# EAGLE design automation-v3 (EAGLE 7.6.0)
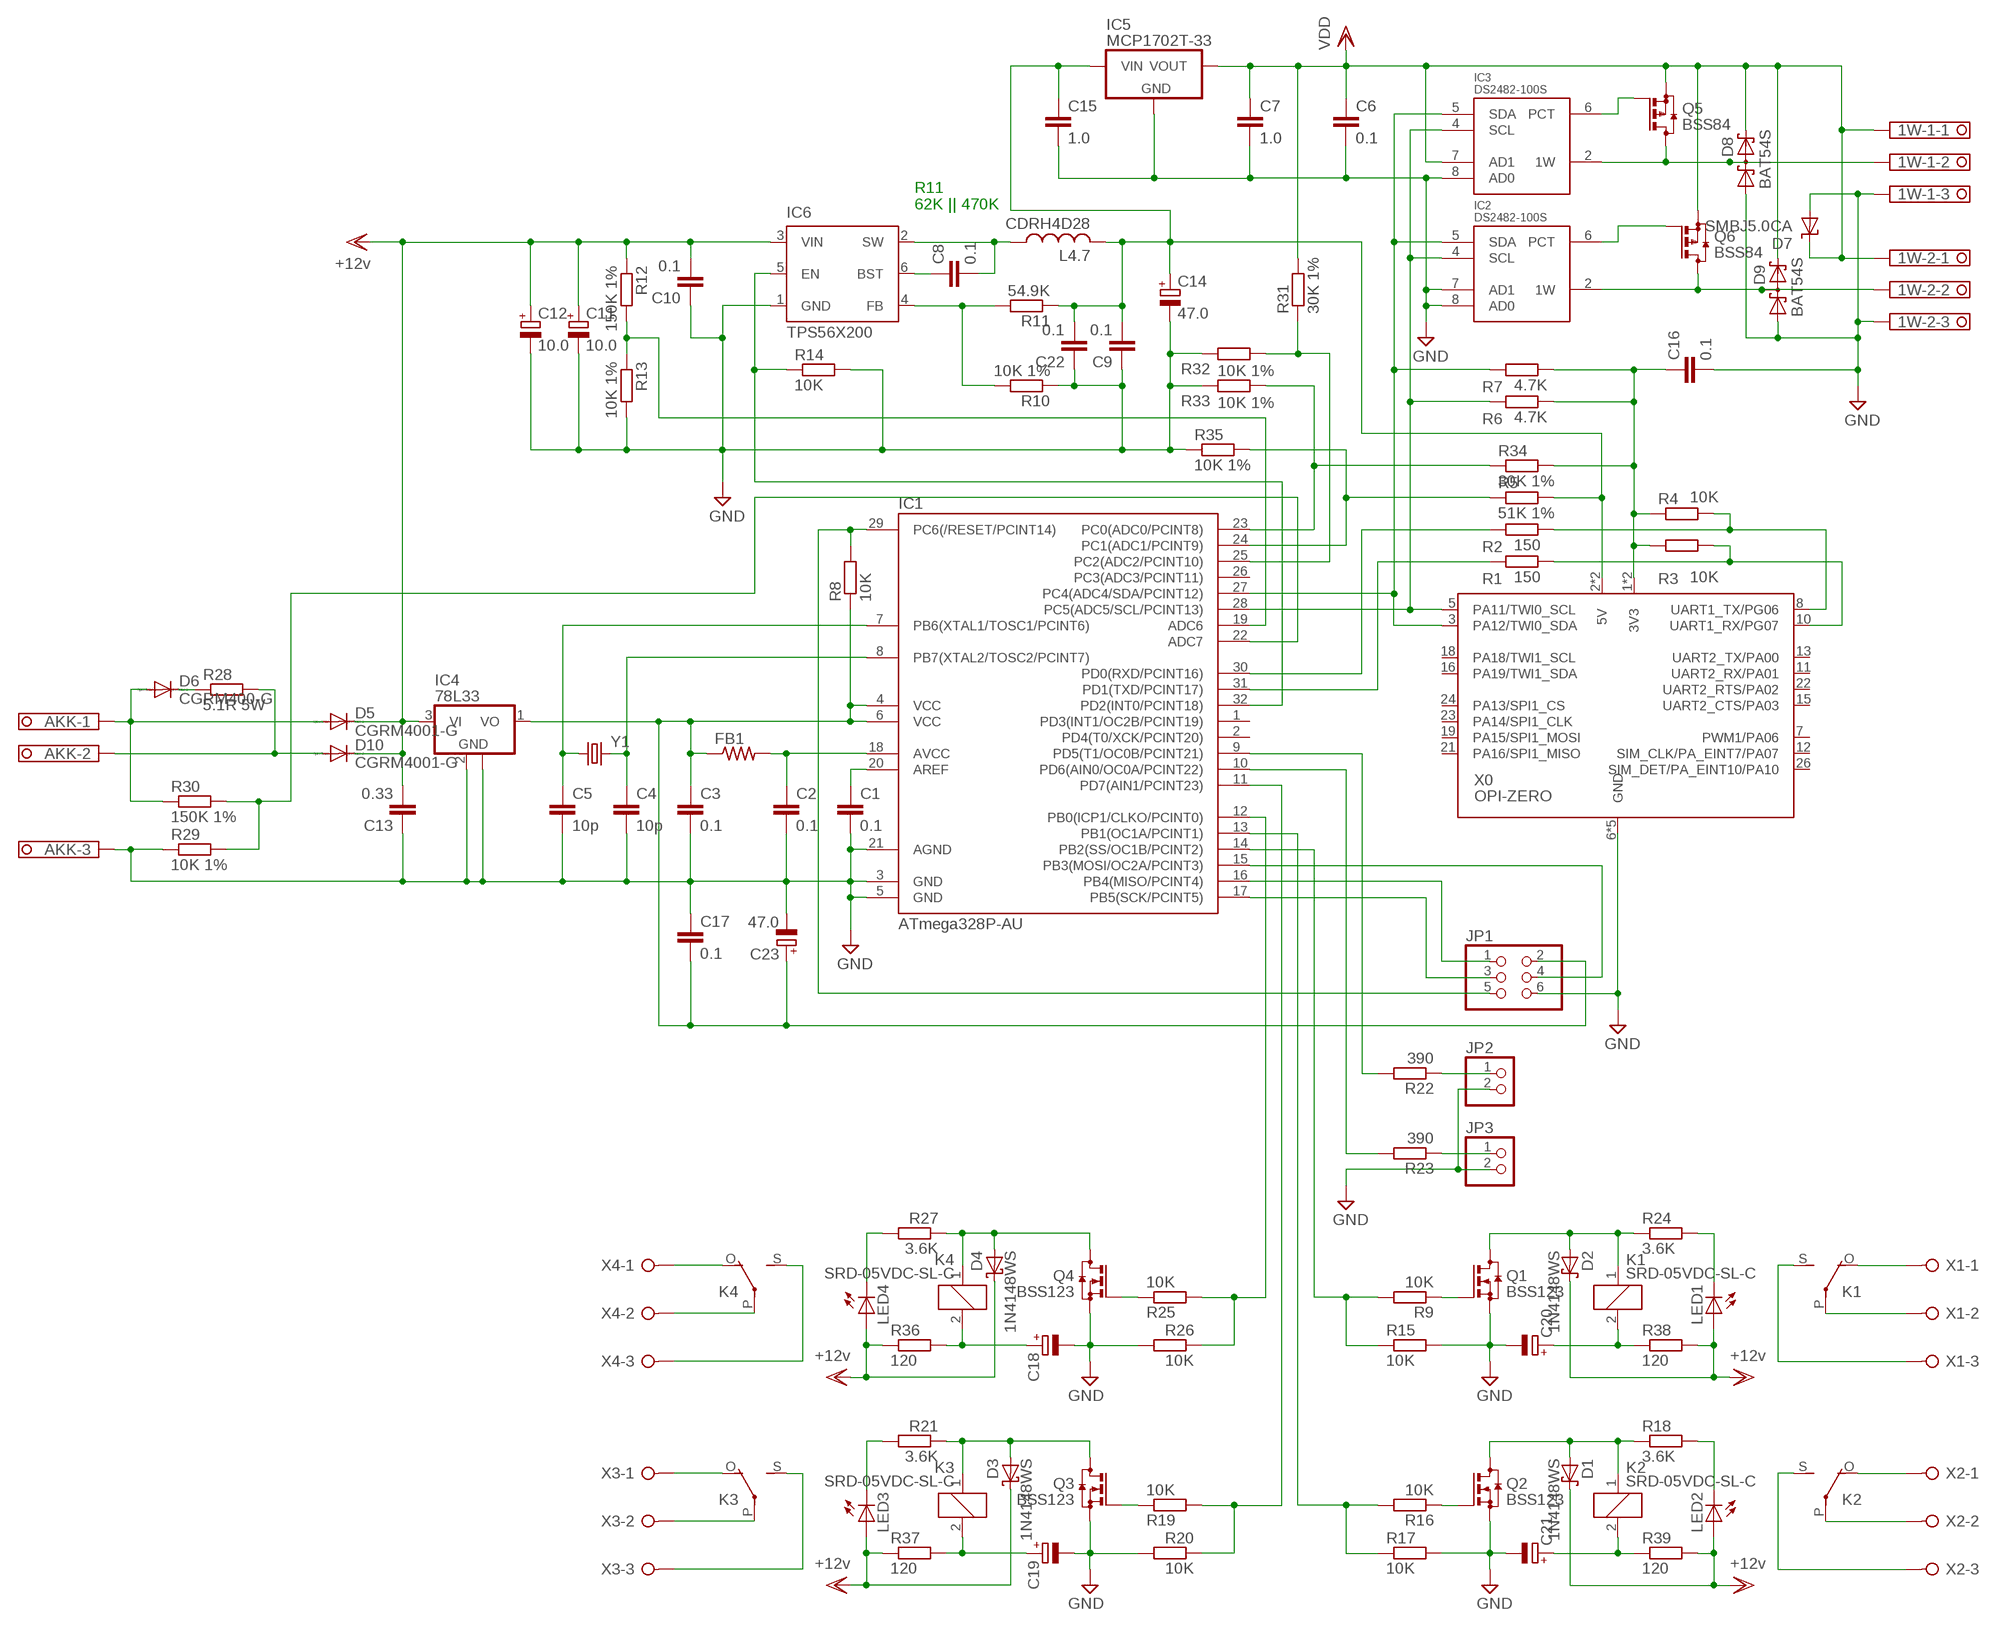
[diagram p0: schematic, sheet 1]

## Parts
1W-1  1751251  [1751251]
1W-2  1751251  [1751251]
AKK  1751251  [1751251]
C1  0.1  C-EUC0603  [C0603]
C2  0.1  C-EUC0603  [C0603]
C3  0.1  C-EUC0603  [C0603]
C4  10p  C-EUC0603  [C0603]
C5  10p  C-EUC0603  [C0603]
C6  0.1  C-EUC0603  [C0603]
C7  1.0  C-EUC0805  [C0805]
C8  0.1  C-EUC0805  [C0805]
C9  0.1  C-EUC0805  [C0805]
C10  0.1  C-EUC0805  [C0805]
C11  10.0  CPOL-EUC/6032-28R  [C/6032-28R]
C12  10.0  CPOL-EUC/6032-28R  [C/6032-28R]
C13  0.33  C-EUC0805  [C0805]
C14  47.0  CPOL-EUB/3528-21R  [B/3528-21R]
C15  1.0  C-EUC0805  [C0805]
C16  0.1  C-EUC0603  [C0603]
C17  0.1  C-EUC0603  [C0603]
C18  CPOL-EUE5-10.5  [E5-10,5]
C19  CPOL-EUE5-10.5  [E5-10,5]
C20  CPOL-EUE5-10.5  [E5-10,5]
C21  CPOL-EUE5-10.5  [E5-10,5]
C22  0.1  C-EUC0805  [C0805]
C23  47.0  CPOL-EUB/3528-21R  [B/3528-21R]
D1  1N4148WS  BAT60J  [SOD323_ST]
D2  1N4148WS  BAT60J  [SOD323_ST]
D3  1N4148WS  BAT60J  [SOD323_ST]
D4  1N4148WS  BAT60J  [SOD323_ST]
D5  CGRM4001-G  [SOD-123_MINI-SMA]
D6  CGRM400-G  CGRM4001-G  [SOD-123_MINI-SMA]
D7  SMBJ5.0CA  SUPPRESSOR-SMBJ  [SMBJ]
D8  BAT54S  [SOT23]
D9  BAT54S  [SOT23]
D10  CGRM4001-G  [SOD-123_MINI-SMA]
FB1  R-US_R0805  [R0805]
IC1  ATmega328P-AU  MEGA48/88/168-AU  [TQFP32-08]
IC2  DS2482-100S  [SO08]
IC3  DS2482-100S  [SO08]
IC4  78L33  78L05F  [SOT89]
IC5  MCP1702T-33  MCP1702SOT23  [SOT23-3-ROTATED]
IC6  TPS56X200  [TSOT23-6_DDC]
JP1  PINHD-2X3  [2X03]
JP2  PINHD-1X2  [1X02]
JP3  PINHD-1X2  [1X02]
K1  SRD-05VDC-SL-C  ZF112S  [NRP18]
K2  SRD-05VDC-SL-C  ZF112S  [NRP18]
K3  SRD-05VDC-SL-C  ZF112S  [NRP18]
K4  SRD-05VDC-SL-C  ZF112S  [NRP18]
L4.7  CDRH4D28  [CDRH4D28]
LED1  LEDSML0805  [SML0805]
LED2  LEDSML0805  [SML0805]
LED3  LEDSML0805  [SML0805]
LED4  LEDSML0805  [SML0805]
Q1  BSS123  [SOT23]
Q2  BSS123  [SOT23]
Q3  BSS123  [SOT23]
Q4  BSS123  [SOT23]
Q5  BSS84  [SOT23]
Q6  BSS84  [SOT23]
R1  150  R-EU_R0603  [R0603]
R2  150  R-EU_R0603  [R0603]
R3  10K  R-EU_R0603  [R0603]
R4  10K  R-EU_R0603  [R0603]
R5  51K 1%  R-EU_R0603  [R0603]
R6  4.7K  R-EU_R0603  [R0603]
R7  4.7K  R-EU_R0603  [R0603]
R8  10K  R-EU_R0603  [R0603]
R9  10K  R-EU_R0603  [R0603]
R10  10K 1%  R-EU_R0603  [R0603]
R11  54.9K  R-EU_R0603  [R0603]
R12  150K 1%  R-EU_R0603  [R0603]
R13  10K 1%  R-EU_R0603  [R0603]
R14  10K  R-EU_R0603  [R0603]
R15  10K  R-EU_R0603  [R0603]
R16  10K  R-EU_R0603  [R0603]
R17  10K  R-EU_R0603  [R0603]
R18  3.6K  R-EU_R0603  [R0603]
R19  10K  R-EU_R0603  [R0603]
R20  10K  R-EU_R0603  [R0603]
R21  3.6K  R-EU_R0603  [R0603]
R22  390  R-EU_R0603  [R0603]
R23  390  R-EU_R0603  [R0603]
R24  3.6K  R-EU_R0603  [R0603]
R25  10K  R-EU_R0603  [R0603]
R26  10K  R-EU_R0603  [R0603]
R27  3.6K  R-EU_R0603  [R0603]
R28  5.1R 5W  R-EU_VTA55  [VTA55]
R29  10K 1%  R-EU_R0603  [R0603]
R30  150K 1%  R-EU_R0603  [R0603]
R31  30K 1%  R-EU_R0603  [R0603]
R32  10K 1%  R-EU_R0603  [R0603]
R33  10K 1%  R-EU_R0603  [R0603]
R34  30K 1%  R-EU_R0603  [R0603]
R35  10K 1%  R-EU_R0603  [R0603]
R36  120  R-EU_M1206  [M1206]
R37  120  R-EU_M1206  [M1206]
R38  120  R-EU_M1206  [M1206]
R39  120  R-EU_M1206  [M1206]
X0  OPI-ZERO  [OPI0]
X1  W237-03P  [W237-133]
X2  W237-03P  [W237-133]
X3  W237-03P  [W237-133]
X4  W237-03P  [W237-133]
Y1  CRYSTALHC49US  [HC49US]

## Nets
12V [POWER]: C10.2 C11.+ C12.+ C13.2 D1.C D2.C D3.C D4.C D5.C D10.C IC4.3(VI) IC6.3(VIN) LED1.A LED2.A LED3.A LED4.A R12.1 R36.1 R37.1 R38.2 R39.2 ; supply symbol labelled +12v
GND [POWER]: 1W-1.3 1W-2.3 AKK.3 C1.2 C2.2 C3.2 C4.2 C5.2 C6.2 C7.2 C9.1 C10.1 C11.- C12.- C13.1 C14.- C15.2 C16.2 C17.1 C18.- C19.- C20.- C21.- C22.1 C23.- D7.A D8.1(A1) D9.1(A1) IC1.3(GND) IC1.5(GND) IC1.21(AGND) IC2.7(AD1) IC2.8(AD0) IC3.8(AD0) IC4.2(GND) IC4.2@1(GND) IC5.1(GND) IC6.1(GND) JP1.6 JP2.2 JP3.2 Q1.2(S) Q2.2(S) Q3.2(S) Q4.2(S) R10.1 R13.2 R14.2 R15.2 R17.2 R20.2 R26.2 R29.1 R32.2 R33.2 R35.1 X0.6(GND) X0.9(GND) X0.14(GND) X0.20(GND) X0.25(GND)
N$3 [POWER]: C8.2 IC6.2(SW) L4.7.P$1
N$4: C4.1 IC1.8(PB7(XTAL2/TOSC2/PCINT7)) Y1.2
N$5: IC1.30(PD0(RXD/PCINT16)) R2.1
N$6: IC1.31(PD1(TXD/PCINT17)) R1.1
N$7: R1.2 R3.2 X0.10(UART1_RX/PG07)
N$8: R2.2 R4.2 X0.8(UART1_TX/PG06)
N$9: C18.+ K4.2 R36.2
N$10: C5.1 IC1.7(PB6(XTAL1/TOSC1/PCINT6)) Y1.1
N$11: IC1.24(PC1(ADC1/PCINT9)) R5.1 R35.2
N$12 [POWER]: AKK.1 D5.A D6.A R30.1
N$13: IC1.29(PC6(/RESET/PCINT14)) JP1.5 R8.2
N$14: C19.+ K3.2 R37.2
N$15: C1.1 IC1.20(AREF)
N$16: C2.1 FB1.2 IC1.18(AVCC)
N$17: C8.1 IC6.6(BST)
N$18: IC1.15(PB3(MOSI/OC2A/PCINT3)) JP1.4
N$19: IC1.17(PB5(SCK/PCINT5)) JP1.3
N$20: IC1.16(PB4(MISO/PCINT4)) JP1.1
N$21: IC3.6(PCT) Q5.1(G)
N$22: IC6.4(FB) R10.2 R11.2
N$23: IC1.14(PB2(SS/OC1B/PCINT2)) R9.2 R15.1
N$24: IC1.13(PB1(OC1A/PCINT1)) R16.2 R17.1
N$25: IC1.19(ADC6) R12.2 R13.1
N$26: Q1.1(G) R9.1
N$27: IC1.32(PD2(INT0/PCINT18)) IC6.5(EN) R14.1
N$28 [HV]: K1.P(2:P) X1.2
N$29 [POWER]: D6.C R28.1
N$30: 1W-1.2 D8.3(C1A2) IC3.2(1W) Q5.3(D)
N$31 [POWER]: AKK.2 D10.A R28.2
N$32 [HV]: K1.S(2:S) X1.3
N$33 [HV]: K1.O(2:O) X1.1
N$34: Q2.1(G) R16.1
N$35: D1.A K2.1 Q2.3(D) R18.1
N$36: LED2.C R18.2
N$37: IC1.10(PD6(AIN0/OC0A/PCINT22)) R23.2
N$38: IC1.9(PD5(T1/OC0B/PCINT21)) R22.2
N$39: JP2.1 R22.1
N$40: JP3.1 R23.1
N$41: D2.A K1.1 Q1.3(D) R24.1
N$42 [HV]: K2.P(2:P) X2.2
N$43: LED1.C R24.2
N$44 [HV]: K2.S(2:S) X2.3
N$45 [HV]: K2.O(2:O) X2.1
N$46: IC1.11(PD7(AIN1/PCINT23)) R19.2 R20.1
N$47: Q3.1(G) R19.1
N$48: D3.A K3.1 Q3.3(D) R21.1
N$49: LED3.C R21.2
N$50 [HV]: K3.P(2:P) X3.2
N$51 [HV]: K3.S(2:S) X3.3
N$52 [HV]: K3.O(2:O) X3.1
N$53: IC1.12(PB0(ICP1/CLKO/PCINT0)) R25.2 R26.1
N$54: Q4.1(G) R25.1
N$55: D4.A K4.1 Q4.3(D) R27.1
N$56: LED4.C R27.2
N$57 [HV]: K4.P(2:P) X4.2
N$58 [HV]: K4.S(2:S) X4.3
N$59 [HV]: K4.O(2:O) X4.1
N$60: 1W-2.2 D9.3(C1A2) IC2.2(1W) Q6.3(D)
N$61: IC1.22(ADC7) R29.2 R30.2
N$62: IC1.25(PC2(ADC2/PCINT10)) R31.1 R32.1
N$63: C20.+ K1.2 R38.1
N$64: IC1.23(PC0(ADC0/PCINT8)) R33.1 R34.1
N$65: IC2.6(PCT) Q6.1(G)
N$66: C21.+ K2.2 R39.1
SCL: IC1.28(PC5(ADC5/SCL/PCINT13)) IC2.4(SCL) IC3.4(SCL) R6.1 X0.5(PA11/TWI0_SCL)
SDA: IC1.27(PC4(ADC4/SDA/PCINT12)) IC2.5(SDA) IC3.5(SDA) R7.1 X0.3(PA12/TWI0_SDA)
VCC [POWER]: C3.1 C17.2 C23.+ FB1.1 IC1.4(VCC) IC1.6(VCC) IC4.1(VO) JP1.2 R8.1
VDD: 1W-1.1 1W-2.1 C6.1 C7.1 D7.C D8.2(C2) D9.2(C2) IC3.7(AD1) IC5.2(VOUT) Q5.2(S) Q6.2(S) R31.2
Z3V3 [POWER]: C16.1 R3.1 R4.1 R6.2 R7.2 R34.2 X0.1(3V3) X0.17(3V3)
Z5V [POWER]: C9.2 C14.+ C15.1 C22.2 IC5.3(VIN) L4.7.P$2 R5.2 R11.1 X0.2(5V) X0.4(5V)
Unconnected: IC1.1(PD3(INT1/OC2B/PCINT19)) IC1.2(PD4(T0/XCK/PCINT20)) IC1.26(PC3(ADC3/PCINT11)) X0.7(PWM1/PA06) X0.11(UART2_RX/PA01) X0.12(SIM_CLK/PA_EINT7/PA07) X0.13(UART2_TX/PA00) X0.15(UART2_CTS/PA03) X0.16(PA19/TWI1_SDA) X0.18(PA18/TWI1_SCL) X0.19(PA15/SPI1_MOSI) X0.21(PA16/SPI1_MISO) X0.22(UART2_RTS/PA02) X0.23(PA14/SPI1_CLK) X0.24(PA13/SPI1_CS) X0.26(SIM_DET/PA_EINT10/PA10)

## Notes on the sheet
- R11
  62K || 470K

## Power pins joined to a net without a drawn wire
GND: IC2.3(GND) IC3.3(GND)
VDD: IC2.1(VDD) IC3.1(VDD)

## Library data of the parts
1W-1 1W-2 AKK = con-phoenix-350:1751251: MKDS 1/ 3-3,5 Printklemme Nennstrom: 10 A Bemessungsspannung: 160 V Raster: 3,5 mm Polzahl: 3 Montageart: Löten Anschlussart: Schraubanschluss Anschlussrichtung vom Leiter zur Platine: 0° Source: http://eshop.phoenixcontact.com .. 1751251.pdf; OC_FARNELL: unknown; OC_NEWARK: unknown
C1-C10 C13 C15-C17 C22 = rcl:C-EU: CAPACITOR, European symbol
C11 C12 C14 C18-C21 C23 = rcl:CPOL-EU: POLARIZED CAPACITOR, European symbol
D1-D4 = diode:BAT60J: Schottky barrier diode Source: www.st.com, BAT60J.pdf
D5 D6 D10 = diode:CGRM400*-G: Molded plasitc,JEDEC SOD-123/Mini SMA Source: Comchip CGRM4001-G.pdf
D7 = diode:SUPPRESSOR-: Suppressor diode
D8 D9 = diode:BAT54S: Schottky Diodes Pin connection corrected 2011-05-04 Source: Fairchild .. BAT54.pdf
FB1 = rcl:R-US_: RESISTOR, American symbol
IC1 = avr-7:MEGA48/88/168
IC2 IC3 = 1wire:DS2482-100: I2C to 1-Wire Host Adapter/Line Driver This device is a onewire host and I2C interface in one chip. It provides the complete DC/AC requirements for onewire communication, including overdrive speed mode, but, unlike the DS2480B chip, no 12V EPROM programming. Notes: For overdrive speed and 5V EEPROM programming, an external active pullup circuit must be connected to the 1W, VDD and PCT pin. See the datasheet for details. The lower two I2C adress bits of the chip can be selected by external pins, so up to 4 chips may be connected to the same I2C bus. Author: Orginal device and description from Giovanni Varasano <giovanni.varasano@fastwebnet.it> Improved by Jan Kandziora <jjj@gmx.de>
IC4 = linear:78L*: POSITOIV-VOLTAGE REGULATORS Output up to 100 mA Source: Datasheet <http://focus.ti.com/lit/ds/symlink/ua78l05.pdf>
IC5 = SteveMarple:MCP1702: Microchip MCP1702 250mA low quiescent current (2uA) LDO voltage regulator.
IC6 = custom:TPS56X200
JP1 = pinhead:PINHD-2X3: PIN HEADER
JP2 JP3 = pinhead:PINHD-1X2: PIN HEADER
K1-K4 = relay:ZF112: RELAY 1 x switch
L4.7 = custom:CDRH4D28
LED1-LED4 = led:LED: LED OSRAM: - CHIPLED LG R971, LG N971, LY N971, LG Q971, LY Q971, LO R971, LY R971 LH N974, LH R974 LS Q976, LO Q976, LY Q976 LO Q996 - Hyper CHIPLED LW Q18S LB Q993, LB Q99A, LB R99A - SideLED LS A670, LO A670, LY A670, LG A670, LP A670 LB A673, LV A673, LT A673, LW A673 LH A674 LY A675 LS A676, LA A676, LO A676, LY A676, LW A676 LS A679, LY A679, LG A679 - Hyper Micro SIDELED® LS Y876, LA Y876, LO Y876, LY Y876 LT Y87S - SmartLED LW L88C, LW L88S LB L89C, LB L89S, LG L890 LS L89K, LO L89K, LY L89K LS L896, LA L896, LO L896, LY L896 - TOPLED LS T670, LO T670, LY T670, LG T670, LP T670 LSG T670, LSP T670, LSY T670, LOP T670, LYG T670 LG T671, LOG T671, LSG T671 LB T673, LV T673, LT T673, LW T673 LH T674 LS T676, LA T676, LO T676, LY T676, LB T676, LH T676, LSB T676, LW T676 LB T67C, LV T67C, LT T67C, LS T67K, LO T67K, LY T67K, LW E67C LS E67B, LA E67B, LO E67B, LY E67B, LB E67C, LV E67C, LT E67C LW T67C LS T679, LY T679, LG T679 LS T770, LO T770, LY T770, LG T770, LP T770 LB T773, LV T773, LT T773, LW T773 LH T774 LS E675, LA E675, LY E675, LS T675 LS T776, LA T776, LO T776, LY T776, LB T776 LHGB T686 LT T68C, LB T68C - Hyper Mini TOPLED® LB M676 - Mini TOPLED Santana® LG M470 LS M47K, LO M47K, LY M47K Source: http://www.osram.convergy.de LUXEON: - LUMILED® LXK2-PW12-R00, LXK2-PW12-S00, LXK2-PW14-U00, LXK2-PW14-V00 LXK2-PM12-R00, LXK2-PM12-S00, LXK2-PM14-U00 LXK2-PE12-Q00, LXK2-PE12-R00, LXK2-PE12-S00, LXK2-PE14-T00, LXK2-PE14-U00 LXK2-PB12-K00, LXK2-PB12-L00, LXK2-PB12-M00, LXK2-PB14-N00, LXK2-PB14-P00, LXK2-PB14-Q00 LXK2-PR12-L00, LXK2-PR12-M00, LXK2-PR14-Q00, LXK2-PR14-R00 LXK2-PD12-Q00, LXK2-PD12-R00, LXK2-PD12-S00 LXK2-PH12-R00, LXK2-PH12-S00 LXK2-PL12-P00, LXK2-PL12-Q00, LXK2-PL12-R00 Source: www.luxeon.com KINGBRIGHT: KA-3528ASYC Source: www.kingbright.com
Q1-Q4 = transistor-small-signal:BSS123: N-CHANNEL MOS FET
Q5 Q6 = transistor-small-signal:BSS84: P-CHANNEL MOS FET
R1-R39 = rcl:R-EU_: RESISTOR, European symbol
X0 = OrangePi0:OPI-ZERO: Orange Pi Zero Footprint. Only 2x13 pin header. -- UNTESTED!
X1-X4 = con-wago-508:W237-03P: WAGO SREW CLAMP; OC_FARNELL: unknown; OC_NEWARK: unknown
Y1 = SteveMarple:CRYSTAL: Crystals Various standard crystals. Proven footprints. Spark Fun Electronics SKU : COM-00534

## Net classes
0 default: width 0.254 mm, clearance 0.254 mm
1 POWER: width 0.508 mm, clearance 0.254 mm
2 HV: width 1.27 mm, clearance 1.27 mm

## Board
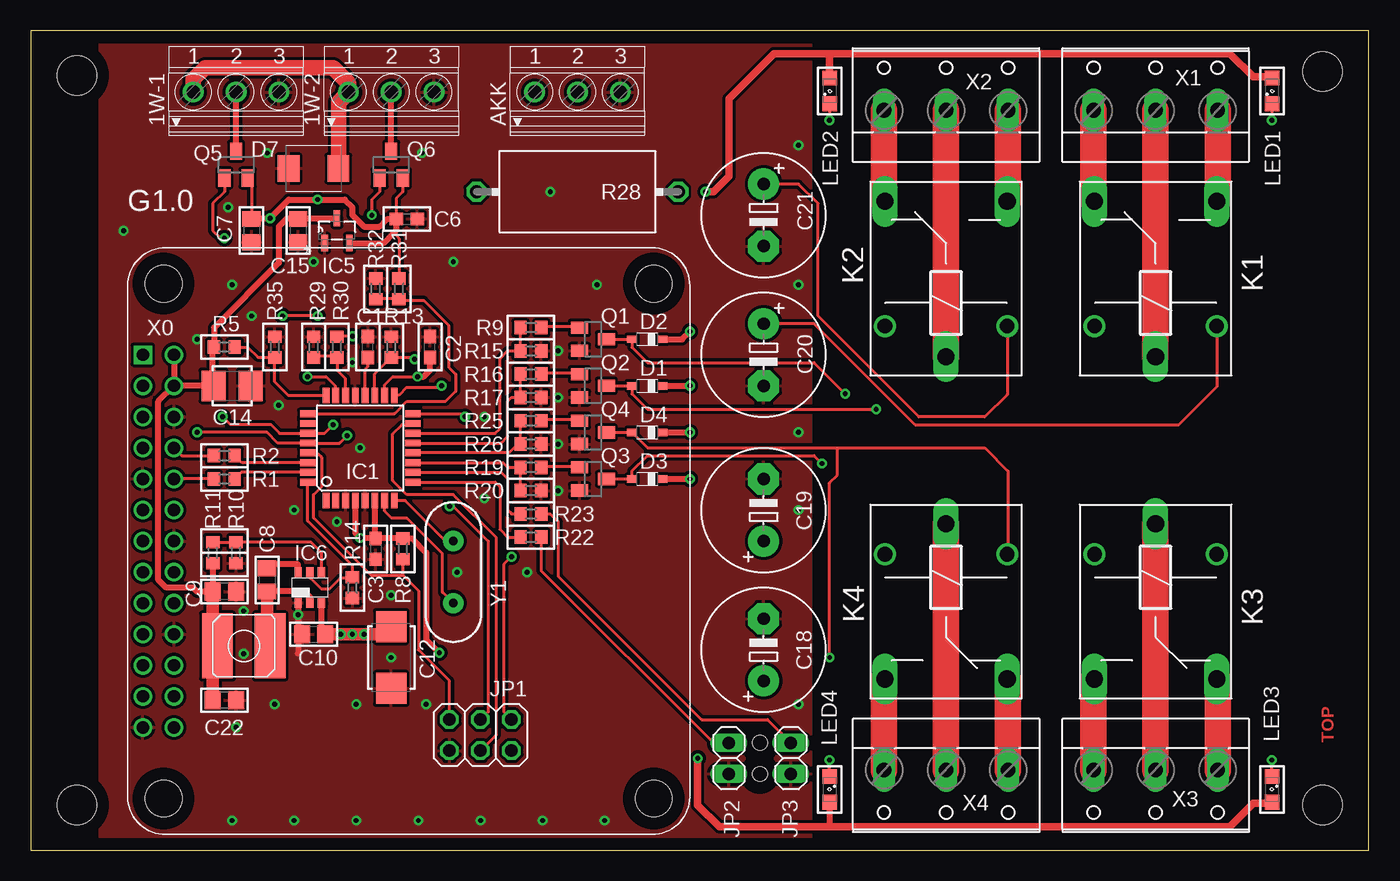
[diagram p1: board, top side]
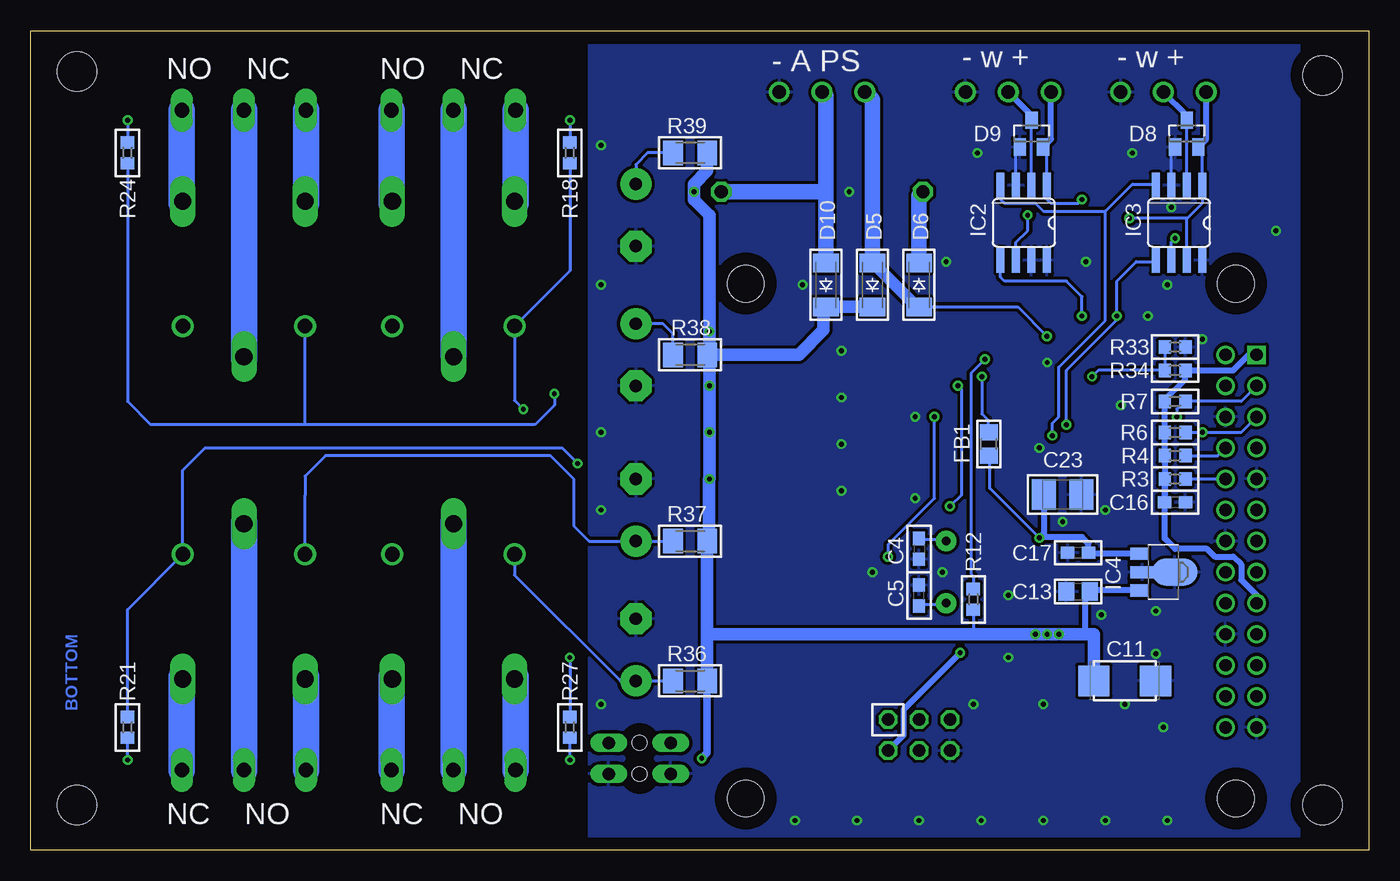
[diagram p2: board, bottom side, seen from below]

Size 109.53 x 67.04 mm. Coordinates in mm from the lower left corner, seen from the top.
Outline: 109.53,0 109.53,67.04 0,67.04 0,0 109.53,0
Copper layers (1*16): Top 0.035mm / dielectric 1.5mm / Bottom 0.035mm
Design rules "default *": minimum track width 10mil, minimum drill 16mil, track to track 10mil, track to pad 10mil, pad to pad 10mil, via to via 10mil, smd to smd 10mil, copper to edge 40mil, drill to drill 10mil, minimum pad ring 10mil, minimum via ring 8mil, stop-mask expansion 4mil, vias tented up to drill 20mil, thermal gap 10mil
Holes 3.2 mm at 3.8,63.37 105.72,63.69 105.72,3.68 3.8,3.68
Holes 1.2 mm at 59.68,8.76 59.68,6.22

### Footprints (pad centres in the part's own frame; a part is rotated, then mirrored left to right if it is on the bottom)
1751251 = drill 1.1 pad 1.7: 1 -3.5,-0.1; 2 0,-0.1; 3 3.5,-0.1
C0603 = smd 1.1 x 1: 1 -0.85,0; 2 0.85,0
C0805 = smd 1.3 x 1.5: 1 -0.95,0; 2 0.95,0
C/6032-28R = smd 2.55 x 2.5: + 2.525,0; - -2.525,0
B/3528-21R = smd 1.95 x 2.5: + 1.525,0; - -1.525,0
E5-10,5 = drill 1.016 pad 2.54: + -2.54,0 | drill 1.016 pad 2.54 octagon: - 2.54,0
SOD323_ST = smd 0.8 x 0.6: A 1.25,0; C -1.25,0
SOD-123_MINI-SMA = smd 1.5 x 2.1: A 1.8,0; C -1.8,0
SMBJ = smd 1.78 x 2.16: A 2.04,0; C -2.03,0
SOT23 = smd 1 x 1.4: 1 -0.95,-1.1; 2 0.95,-1.1; 3 0,1.1
R0805 = smd 1.3 x 1.5: 1 -0.95,0; 2 0.95,0
TQFP32-08 = smd 1.27 x 0.559: 1 -4.293,2.8; 2 -4.293,2; 3 -4.293,1.2; 4 -4.293,0.4; 5 -4.293,-0.4; 6 -4.293,-1.2; 7 -4.293,-2; 8 -4.293,-2.8; 17 4.293,-2.8; 18 4.293,-2; 19 4.293,-1.2; 20 4.293,-0.4; 21 4.293,0.4; 22 4.293,1.2; 23 4.293,2; 24 4.293,2.8 | smd 0.559 x 1.27: 9 -2.8,-4.293; 10 -2,-4.293; 11 -1.2,-4.293; 12 -0.4,-4.293; 13 0.4,-4.293; 14 1.2,-4.293; 15 2,-4.293; 16 2.8,-4.293; 25 2.8,4.293; 26 2,4.293; 27 1.2,4.293; 28 0.4,4.293; 29 -0.4,4.293; 30 -1.2,4.293; 31 -2,4.293; 32 -2.8,4.293
SO08 = smd 0.66 x 2.032: 1 -1.905,-3.073; 2 -0.635,-3.073; 3 0.635,-3.073; 4 1.905,-3.073; 5 1.905,3.073; 6 0.635,3.073; 7 -0.635,3.073; 8 -1.905,3.073
SOT89 = smd 1 x 1.5: 1 -1.499,-1.981; 3 1.499,-1.981 | smd 1 x 2: 2 0,-1.727 | smd 2.2 x 3.7: 2@1 0,0.94
SOT23-3-ROTATED = smd 1.321 x 0.559: 1 -1.016,1.016; 2 -1.016,-1.016; 3 1.016,0
TSOT23-6_DDC = smd 0.6 x 0.8: 1 -0.95,-1.25; 2 0,-1.25; 3 0.95,-1.25; 4 0.95,1.25; 5 0,1.25; 6 -0.95,1.25
2X03 = drill 1.016 octagon: 1 -2.54,-1.27; 2 -2.54,1.27; 3 0,-1.27; 4 0,1.27; 5 2.54,-1.27; 6 2.54,1.27
1X02 = drill 1.016 long: 1 -1.27,0; 2 1.27,0
NRP18 = drill 1.2: 1 -4,5; 2 -4,-5 | drill 1.4 long: O 6.2,5; P -6.5,0; S 6.2,-5
CDRH4D28 = smd 2.5 x 5.3: P$1 -2.159,0; P$2 2.159,0
SML0805 = smd 1.2 x 1.2: A 1.05,0; C -1.05,0
R0603 = smd 1 x 1.1: 1 -0.85,0; 2 0.85,0
VTA55 = drill 1.1 octagon: 1 -8.255,0; 2 8.255,0
M1206 = smd 1.6 x 2: 1 -1.4,0; 2 1.4,0
OPI0 = drill 1 square: 1 0,0 | drill 1: 2 0,2.54; 3 2.54,0; 4 2.54,2.54; 5 5.08,0; 6 5.08,2.54; 7 7.62,0; 8 7.62,2.54; 9 10.16,0; 10 10.16,2.54; 11 12.7,0; 12 12.7,2.54; 13 15.24,0; 14 15.24,2.54; 15 17.78,0; 16 17.78,2.54; 17 20.32,0; 18 20.32,2.54; 19 22.86,0; 20 22.86,2.54; 21 25.4,0; 22 25.4,2.54; 23 27.94,0; 24 27.94,2.54; 25 30.48,0; 26 30.48,2.54 | hole 3: -5.815,1.694; 36.295,1.694; 36.295,41.805; -5.815,41.805
W237-133 = drill 1.194 long: 1 -5.08,-0.635; 2 0,-0.635; 3 5.08,-0.635
HC49US = drill 0.7 pad 1.651: 1 -2.54,0; 2 2.54,0

### Placement (x,y rotation side)
1W-1  16.81,62.1 0 top
1W-2  29.52,62.1 0 top
AKK  44.75,62.1 0 top
C1  27.61,41.15 90 top
C2  32.69,41.15 90 top
C3  28.25,24.64 270 top
C4  36.82,24.64 270 bottom
C5  36.82,20.83 90 bottom
C6  30.79,51.63 0 top
C7  18.09,50.67 270 top
C8  19.36,22.1 270 top
C9  15.86,21.15 180 top
C10  23.16,17.65 0 top
C11  19.99,13.84 180 bottom
C12  29.52,15.75 90 top
C13  23.8,21.15 0 bottom
C14  16.5,37.97 180 top
C15  21.89,50.67 270 top
C16  15.86,28.45 0 bottom
C17  23.8,24.32 0 bottom
C18  60,16.38 90 top
C19  60,27.81 90 top
C20  60,40.51 270 top
C21  60,51.94 270 top
C22  15.86,12.26 180 top
C23  25.07,29.08 180 bottom
D1  50.47,37.97 180 top
D2  50.47,41.78 180 top
D3  50.47,30.35 180 top
D4  50.47,34.16 180 top
D5  40.63,46.23 90 bottom
D6  36.82,46.23 270 bottom
D7  23.16,55.75 180 top
D8  14.91,58.61 0 bottom
D9  27.61,58.61 0 bottom
D10  44.44,46.23 90 bottom
FB1  31.1,33.21 90 bottom
IC1  26.98,32.89 90 top
IC2  28.25,51.31 180 bottom
IC3  15.54,51.31 180 bottom
IC4  16.81,22.73 270 bottom
IC5  25.07,50.67 90 top
IC6  22.85,21.46 0 top
JP1  36.82,9.4 180 top
JP2  57.14,7.49 270 top
JP3  62.22,7.49 270 top
K1  92.06,46.86 90 top
K2  74.92,46.86 90 top
K3  92.06,20.19 270 top
K4  74.92,20.19 270 top
L4.7  17.45,16.7 180 top
LED1  101.59,62.1 90 top
LED2  65.39,62.1 90 top
LED3  101.59,4.95 270 top
LED4  65.39,4.95 270 top
Q1  46.03,41.78 270 top
Q2  46.03,37.97 270 top
Q3  46.03,30.35 270 top
Q4  46.03,34.16 270 top
Q5  16.81,56.07 0 top
Q6  29.52,56.07 0 top
R1  15.86,30.35 180 top
R2  15.86,32.26 180 top
R3  15.86,30.35 0 bottom
R4  15.86,32.26 0 bottom
R5  15.86,41.15 180 top
R6  15.86,34.16 180 bottom
R7  15.86,36.7 180 bottom
R8  30.47,24.64 270 top
R9  40.94,42.74 180 top
R10  16.81,24.32 90 top
R11  14.91,24.32 90 top
R12  32.37,20.51 90 bottom
R13  29.52,41.15 90 top
R14  26.34,21.46 270 top
R15  40.94,40.83 0 top
R16  40.94,38.93 180 top
R17  40.94,37.02 0 top
R18  65.39,57.02 90 bottom
R19  40.94,31.31 180 top
R20  40.94,29.4 0 top
R21  101.59,10.03 270 bottom
R22  40.94,25.59 180 top
R23  40.94,27.5 180 top
R24  101.59,57.02 90 bottom
R25  40.94,35.12 180 top
R26  40.94,33.21 0 top
R27  65.39,10.03 270 bottom
R28  44.75,53.85 0 top
R29  23.16,41.15 270 top
R30  25.07,41.15 270 top
R31  30.15,45.91 90 top
R32  28.25,45.91 90 top
R33  15.86,41.15 0 bottom
R34  15.86,39.24 0 bottom
R35  19.99,41.15 270 top
R36  55.55,13.84 180 bottom
R37  55.55,25.27 180 bottom
R38  55.55,40.51 0 bottom
R39  55.55,57.02 0 bottom
X0  9.2,40.51 270 top
X1  92.06,61.15 0 top
X2  74.92,61.15 0 top
X3  92.06,5.91 180 top
X4  74.92,5.91 180 top
Y1  34.59,22.73 90 top

### Tracks (layer width: path | path; a pad name or v marks a point on that pad's centre or on a via)
12V  (via drill 0.4)
  Top 0.508: D2.C 53.33,41.78 v53.96,42.42 | D1.C v53.96,37.97 | D4.C v53.96,34.16 | D3.C v53.96,30.35 | 23.8,20.19 23.86,20.19 IC6.3 23.8,17.65 C10.2 | 65.39,3.94 LED4.A | 101.59,3.81 LED3.A | 65.52,3.68 LED4.A | 65.39,63.12 LED2.A 65.52,63.37 | 101.59,63.25 LED1.A | LED4.A 65.39,1.91
  Top 0.61: 101.59,3.81 100.06,3.81 98.16,1.91 65.39,1.91 56.38,1.91 54.6,3.68 v54.6,7.49 | 101.59,63.25 100.06,63.25 98.16,65.15 65.39,65.15 | 65.39,65.15 60.82,65.15 57.14,61.47 57.14,55.12 55.87,53.85 v55.23,53.85 | LED2.A 65.39,65.15
  Top 1.016: 29.18,17.65 C12.+ 29.2,17.65 v27.29,17.65 v26.34,17.65 v25.39,17.65 C10.2
  Bottom 0.254: R12.1 32.37,17.65 | 23.26,17.88
  Bottom 0.508: R36.1 | R37.1 54.03,25.4 | 54.03,41.21 v53.96,42.42 | 54.03,30.29 v53.96,30.35 | 44.37,44.45 D10.C | 44.63,44.32 D10.C | 40.69,44.45 D5.C | 44.12,44.45 D10.C | IC4.3 22.85,21.23 | 22.85,21.23 23.26,21.23 23.26,17.88 | 23.26,17.88 23.48,17.65 | C13.2 22.85,21.23 | R38.2 53.96,40.51
  Bottom 0.61: v54.6,7.49 54.15,7.94 R36.1
  Bottom 1.016: R37.1 54.15,17.65 | 54.15,17.65 R36.1 | v53.96,30.35 v53.96,34.16 v53.96,37.97 53.96,40.51 v53.96,42.42 53.96,51.94 55.23,53.21 v55.23,53.85 55.23,54.48 54.15,55.57 R39.2 | 54.03,25.4 54.03,30.29 | 44.12,44.45 40.69,44.45 | 54.15,17.65 32.37,17.65 v27.29,17.65 23.48,17.65 22.53,17.65 22.53,13.86 C11.+ | 44.63,44.32 44.63,42.54 46.66,40.51 R38.2
GND  (via drill 0.4)
  Top 0.508: IC6.1 21.89,16.07
  Bottom 0.254: IC2.3 28.88,57.19 D9.1 | IC3.3 16.18,57.19 D8.1
  other vias: 43.17,29.4 43.17,33.21 43.17,37.02 43.17,40.83 34.91,22.73 62.85,46.23 7.61,50.67 23.16,48.13 34.59,48.13 13.64,41.78 21.58,27.81 29.52,15.75 42.53,53.85 26.98,32.89 26.66,11.94 37.14,28.77 40.63,22.73 16.5,2.41 26.66,2.41 31.74,2.41 46.98,2.41 19.36,57.02 32.05,57.02 29.52,20.83 37.14,35.43 46.34,46.23 20.31,36.39 18.09,43.69 26.34,39.88 25.07,26.86 32.37,11.94 21.89,19.24 17.45,19.56 17.45,16.07 19.99,11.94 16.81,10.03 62.85,34.16 36.82,2.41 41.9,2.41 21.58,2.41 62.85,27.81 62.85,11.94 62.85,57.66 16.18,52.58 16.5,46.23
  pour Bottom: 5.7,0.83 5.7,66.23 63.81,66.23 63.81,0.83
  pour Top: 5.7,0.83 5.7,66.23 63.81,66.23 63.81,0.83
N$3
  Top 0.508: IC6.2 22.85,20.7 22.34,21.21 19.36,21.21 C8.2
  Top 1.016: L4.7.P$1 19.36,16.95 C8.2
N$4
  Top 0.254: Y1.2 33.96,25.27 30.66,28.58 29.9,28.58 IC1.8
  Bottom 0.254: Y1.2 34.72,25.4 36.75,25.4 C4.1
N$5
  Top 0.254: IC1.30 17.28,31.69 R2.1
N$6
  Top 0.254: IC1.31 17.25,30.89 R1.1
N$7
  Top 0.254: 15.04,30.35 R3.2 X0.10
  Bottom 0.254: R3.2 X0.10
N$8
  Top 0.254: X0.8 12.37,32.26 R4.2
  Bottom 0.254: R4.2 12.37,32.26 X0.8
N$9
  Bottom 0.254: R36.2 C18.+ 61.26,13.84 69.92,22.5 K4.2
N$10
  Top 0.254: 29.01,28.58 IC1.7 28.98,27.72 29.52,27.18 30.79,27.18 33.71,24.26 33.71,21.08 Y1.1
  Bottom 0.254: Y1.1 34.72,20.07 36.75,20.07 C5.1
N$11
  Top 0.254: IC1.24 24.05,37.21 21.07,37.21 19.99,38.29 R35.2 18.62,40.3 17.77,41.15 R5.1
N$12  (via drill 0.41)
  Top 0.254: v26.34,42.04 25.07,42.04
  Top 0.508: 25.07,42.04 R30.1
  Bottom 0.254: D6.A 28.73,44.43 v26.34,42.04
  Bottom 0.508: 36.82,44.32 D6.A 37.01,44.45 | 40.56,48.01 D5.A 40.69,48.26
  Bottom 1.016: 37.01,44.45 40.56,48.01
  Bottom 1.27: D5.A 40.63,61.38 AKK.1
N$13
  Top 0.254: IC1.29 22.78,32.38 23.55,32.38 23.8,32.13 23.8,29.72 23.16,29.08 23.16,27.18 27.86,22.48 30.47,22.48 | 30.47,22.73 R8.2 30.47,22.48 | 30.47,22.48 31.74,21.21 31.74,16.38 34.28,13.84 JP1.5
N$14
  Bottom 0.254: R37.2 C19.+ 63.81,25.27 65.07,26.54 65.07,30.35 66.98,32.26 85.4,32.26 87.06,30.59 87.06,29 87.06,28.45 K3.2
N$15
  Top 0.254: IC1.20 27.38,39.33 27.61,39.56 C1.1
N$16  (via drill 0.41)
  Top 0.254: IC1.18 28.98,38.07 29.64,38.73 v31.67,38.73
  Top 0.508: C2.1 32.69,39.24 32.18,38.73 v31.67,38.73
  Bottom 0.254: v31.67,38.73 31.67,35.69 31.17,35.18 31.17,34.16 FB1.2
N$17
  Top 0.254: IC6.6 | 19.36,23.37 C8.1
  Top 0.508: IC6.6 21.89,23.37 19.36,23.37
N$18
  Top 0.254: IC1.15 31.17,34.8 30.4,34.8 29.64,34.04 29.64,30.23 30.79,29.08 34.6,29.08 38.09,25.59 38.09,9.4 JP1.4
N$19  (via drill 0.4)
  Top 0.254: IC1.17 29.9,37.21 30.15,37.21 30.79,37.85 33.52,37.85 v33.64,37.97 | v34.28,28.13 34.6,28.13 37.45,25.27 37.45,11.3 JP1.3
  Bottom 0.254: v34.28,28.13 33.32,29.08 33.32,37.65 v33.64,37.97
N$20  (via drill 0.4)
  Top 0.254: IC1.16 31.29,35.69 35.29,35.69 v35.55,35.43 | v39.36,24 38.72,23.37 38.72,11.3 JP1.1
  Bottom 0.254: v35.55,35.43 35.55,28.77 39.36,24.96 v39.36,24
N$21  (via drill 0.4)
  Top 0.254: Q5.1 15.87,53.85 14.91,52.9 14.91,50.67 15.55,50.04 v15.86,50.04
  Bottom 0.254: IC3.6 16.18,49.72 v15.86,50.04
N$22
  Top 0.254: IC6.4 23.8,22.73 23.8,24.32 22.95,25.17 R10.2 R11.2
N$23
  Top 0.254: R9.2 40.06,42.67 40.06,40.89 R15.1 39.04,40.83 38.4,40.2 38.4,34.48 38.02,34.09 IC1.14
N$24
  Top 0.254: R16.2 40.06,38.86 40.06,37.08 R17.1 39.36,37.02 39.04,36.7 39.04,33.84 38.49,33.29 IC1.13
N$25  (via drill 0.41)
  Top 0.254: IC1.19 28.18,38.96 R13.1 31.25,40.3 v31.42,40.13
  Bottom 0.254: v31.42,40.13 32.56,38.99 32.56,22.61 32.37,22.42 R12.2
N$26
  Top 0.254: R9.1 41.83,42.8 44.88,42.8 Q1.1
N$27
  Top 0.254: IC6.5 22.91,22.61 22.91,22.23 23.8,21.34 24.43,21.34 25.32,22.23 26.34,22.23 R14.1 26.34,23.24 22.66,26.92 22.66,29.97 IC1.32
N$28
  Top 2.184: K1.P X1.2
  Bottom 2.184: X1.2 92.06,40.2
N$29
  Bottom 1.27: D6.C 36.82,53.53 R28.1
N$30
  Top 0.508: Q5.3 1W-1.2
  Bottom 0.254: IC3.2 D8.3
  Bottom 0.508: D8.3 14.91,60.1 1W-1.2
N$31
  Bottom 1.27: D10.A 44.44,53.85 | 44.44,53.85 44.44,61.68 AKK.2 | R28.2 44.44,53.85
N$32
  Top 1.27: 97.14,53.09 K1.S
  Top 2.184: 97.14,53.09 X1.3
  Bottom 2.184: X1.3 97.14,52.9
N$33
  Top 1.27: 86.98,53.09 K1.O
  Top 2.184: 86.98,53.09 X1.1
  Bottom 2.184: X1.1 86.98,52.9
N$34
  Top 0.254: R16.1 41.83,38.99 44.88,38.99 Q2.1
N$35  (via drill 0.4)
  Top 0.254: Q2.3 D1.A 49.22,37.32 50.47,36.07 v69.2,36.07
  Bottom 0.254: R18.1 65.39,47.39 K2.1 69.92,36.78 v69.2,36.07
N$36  (via drill 0.41)
  Top 0.254: LED2.C v65.39,59.69
  Bottom 0.254: v65.39,59.69 R18.2
N$37
  Top 0.254: IC1.10 38.5,30.89 39.04,30.35 39.04,27.81 39.36,27.5 R23.2
N$38
  Top 0.254: IC1.9 38.03,30.09 38.4,29.72 38.4,26.23 39.04,25.59 R22.2
N$39
  Top 0.254: R22.1 41.79,22.84 55.87,8.76 JP2.1
N$40
  Top 0.254: R23.1 42.53,27.5 43.17,26.86 43.17,22.42 54.92,10.67 60.31,10.67 JP3.1
N$41  (via drill 0.4)
  Top 0.254: Q1.3 D2.A 49.22,41.13 50.47,39.88 64.12,39.88 v66.66,37.34
  Bottom 0.254: R24.1 101.59,36.7 99.68,34.8 87.3,34.8 87.06,34.8 | 87.06,34.8 K1.1 | v66.66,37.34 66.66,36.39 68.25,34.8 87.06,34.8
N$42
  Top 2.184: K2.P X2.2
  Bottom 2.184: X2.2 74.92,40.51
N$43  (via drill 0.41)
  Top 0.254: LED1.C v101.59,59.69
  Bottom 0.254: v101.59,59.69 R24.2
N$44
  Top 1.27: 80,53.09 K2.S
  Top 2.184: 80,53.09 X2.3
  Bottom 2.184: X2.3 80,52.9
N$45
  Top 1.27: 69.84,53.09 K2.O
  Top 2.184: 69.84,53.09 X2.1
  Bottom 2.184: X2.1 69.84,52.9
N$46
  Top 0.254: R20.1 40.06,29.46 40.06,31.24 R19.2 39.04,31.31 38.65,31.69 IC1.11
N$47
  Top 0.254: R19.1 41.83,31.37 44.88,31.37 Q3.1
N$48  (via drill 0.4)
  Top 0.254: Q3.3 D3.A 49.22,31.01 50.47,32.26 64.12,32.26 v64.76,31.62
  Bottom 0.254: R21.1 101.59,19.67 K3.1 97.06,31.07 95.24,32.89 66.03,32.89 v64.76,31.62
N$49  (via drill 0.41)
  Top 0.254: LED3.C v101.59,7.37
  Bottom 0.254: v101.59,7.37 R21.2
N$50
  Top 2.184: K3.P X3.2
  Bottom 2.184: X3.2 92.06,26.86
N$51
  Top 1.27: 86.98,13.97 K3.S
  Top 2.184: 86.98,13.97 X3.3
  Bottom 2.184: X3.3 86.98,14.16
N$52
  Top 1.27: 97.14,13.97 K3.O
  Top 2.184: 97.14,13.97 X3.1
  Bottom 2.184: X3.1 97.14,14.16
N$53
  Top 0.254: R25.2 40.06,35.05 40.06,33.27 R26.1 39.93,33.27 39.17,32.51 31.29,32.51 IC1.12
N$54
  Top 0.254: R25.1 41.83,35.18 44.88,35.18 Q4.1
N$55  (via drill 0.4)
  Top 0.254: Q4.3 D4.A 50.49,32.89 66.03,32.89 | 66.03,32.89 78.09,32.89 80,30.99 80,24.27 K4.1 | v65.39,15.75 65.39,30.04 66.03,30.67 66.03,32.89
  Bottom 0.254: v65.39,15.75 R27.1 | K4.1 80,24.27
N$56  (via drill 0.41)
  Top 0.254: LED4.C v65.39,7.37
  Bottom 0.254: v65.39,7.37 R27.2
N$57
  Top 2.184: K4.P X4.2
  Bottom 2.184: X4.2 74.92,26.86
N$58
  Top 1.27: 69.84,13.97 K4.S
  Top 2.184: 69.84,13.97 X4.3
  Bottom 2.184: X4.3 69.84,14.16
N$59
  Top 1.27: 80,13.97 K4.O
  Top 2.184: 80,13.97 X4.1
  Bottom 2.184: X4.1 80,14.16
N$60
  Top 0.508: Q6.3 1W-2.2
  Bottom 0.254: IC2.2 D9.3
  Bottom 0.508: D9.3 27.61,60.1 1W-2.2
N$61
  Top 0.254: IC1.22 25.77,38.54 25.07,39.24 R30.2 25.07,40.39 23.25,40.39 R29.2
N$62
  Top 0.254: IC1.25 29.77,35.69 30.79,36.7 33.96,36.7 34.79,37.53 34.79,38.93 34.21,39.5 34.21,42.93 32.18,44.96 30.15,44.96 R31.1 30.15,45.09 28.27,45.09 R32.1
N$63
  Top 0.254: K1.2 97.06,37.89 93.97,34.8 72.38,34.8 64.12,43.05 C20.+
  Bottom 0.254: R38.1 56.95,42.23 57.77,43.05 C20.+
N$64  (via drill 0.41)
  Top 0.254: v22.66,38.73 24.18,38.73 24.94,37.97 24.94,37.21 IC1.23
  Bottom 0.254: R34.1 22.15,39.24 v22.66,38.73 | R34.1 16.69,39.24 | R33.1 R34.1
N$65  (via drill 0.4)
  Top 0.254: Q6.1 28.57,53.85 27.93,53.21 v27.93,51.94
  Bottom 0.254: IC2.6 28.88,49.72 27.93,50.67 v27.93,51.94
N$66
  Top 0.254: K2.2 79.92,37.26 78.09,35.43 72.7,35.43 64.44,43.69 64.44,52.9 62.85,54.48 C21.+
  Bottom 0.254: R39.1 59.04,57.02 60,56.07 C21.+
SCL  (via drill 0.4, 0.41)
  Top 0.254: v13.64,34.16 19.36,34.16 20.23,33.29 IC1.28 25.28,33.29 v25.9,33.91
  Bottom 0.254: R6.1 v13.64,34.16 10.47,34.16 X0.5 | 21.58,52.26 19.36,54.48 17.55,54.48 IC3.4 | IC2.4 30.15,53.21 29.83,52.9 27.29,52.9 26.66,52.26 21.58,52.26 | 21.58,52.26 21.58,43.31 25.39,39.5 25.39,35.43 25.9,34.92 v25.9,33.91
SDA  (via drill 0.4, 0.41)
  Top 0.254: v24.75,34.8 24.05,34.09 IC1.27 20.38,34.09 19.67,34.8 16.37,34.8 v15.74,35.43 | v23.48,43.69 v20.63,43.69
  Bottom 0.254: v15.74,35.43 15.74,36.07 15.1,36.7 R7.1 10.47,36.7 X0.3 9.13,37.97 | v24.75,34.8 24.75,39.24 20.63,43.37 v20.63,43.69 | 20.63,43.56 v20.63,43.69 | v20.63,43.69 20.63,46.54 19.04,48.13 17.55,48.13 IC3.5 | v23.48,43.69 23.48,45.28 24.75,46.54 29.83,46.54 30.15,46.86 IC2.5
VCC  (via drill 0.41)
  Top 0.508: C3.1 28.25,25.53 v26.98,25.53 26.57,25.93 IC1.4 | C3.1 28.37,25.53 30.47,25.53 R8.1 31.2,25.49 32.37,24.32 32.37,17.21 v33.45,16.13 | IC1.6 28.18,25.56 C3.1
  Bottom 0.254: 31.04,32.26 31.04,29.59 v26.98,25.53
  Bottom 0.508: IC4.1 18.85,24.26 22.89,24.26 C17.2 22.95,25.06 23.48,25.59 26.91,25.59 v26.98,25.53 26.59,25.91 C23.+ | 31.04,32.26 FB1.1 | v33.45,16.13 38.09,11.49 38.09,9.4 JP1.2
VDD  (via drill 0.4, 0.41)
  Top 0.254: R31.2 30.15,50.04 29.71,50.48 | 29.9,51.56 C6.1 | D7.C 25.39,55.75 | C6.1 29.96,51.69 29.83,51.69 | Q6.2 30.47,53.84 29.93,53.32 C6.1 | Q5.2 18.08,54.65 C7.1 | v19.61,51.69 19.55,51.62
  Top 0.508: 29.9,51.56 29.9,50.67 29.71,50.48 28.88,49.66 IC5.2 | 29.83,51.69 29.83,51.62 | C6.1 29.2,51.62 28.56,50.99 27.29,50.99 26.34,51.94 26.34,52.58 25.7,53.21 v23.48,53.21 21.13,53.21 v19.61,51.69 | 19.55,51.62 19.54,51.62 C7.1
  Top 1.27: D7.C 25.2,61.18 1W-2.1 26.02,62.74 24.75,64.01 14.28,64.01 13.32,63.05 13.32,62.42 13.31,62.41 1W-1.1
  Bottom 0.254: D8.2 13.64,57.19 IC3.1 13.64,52.9 14.85,51.69 14.91,51.69 | 14.91,51.69 v19.61,51.69 | IC3.7 14.91,51.69 | D9.2 26.34,57.19 IC2.1 26.34,53.21 26.02,52.9 23.8,52.9 v23.48,53.21
  Bottom 0.508: D9.2 26.02,58.15 1W-2.1 | D8.2 13.31,58.15 1W-1.1
Z3V3
  Bottom 0.508: X0.17 9.2,20.83 10.47,22.1 10.47,23.37 11.1,24 12.62,24 13.26,24.64 15.86,24.64 16.71,25.49 C16.1 R3.1 16.69,29.08 16.69,31.62 R4.1 16.69,31.75 16.69,34.16 R6.2 16.69,34.29 16.69,36.7 R7.2 16.69,36.83 15.04,38.48 15.04,39.24 R34.2 11.1,39.24 9.83,40.51 X0.1
Z5V
  Top 0.508: X0.2 X0.4 | IC5.3 21.89,51.69 C15.1 20.94,51.62 20.31,50.99 20.31,48.03 15.01,42.73 R5.2 14.91,41.15 14.91,37.97 | 14.91,37.97 C14.+ 14.78,37.85 | X0.4 10.47,36.7 10.47,22.1 11.1,21.46 13.32,21.46 13.64,21.15 C9.2 R11.1 | 14.91,37.97 X0.4
  Top 1.016: C9.2 14.91,17.08 L4.7.P$2 14.91,16.7 C22.2

### Text on the board
Top: TOP
Bottom: BOTTOM
tNames: G1.0
bNames: - w + | - w + | - A PS | NO NC | NO NC | NC NO | NC NO